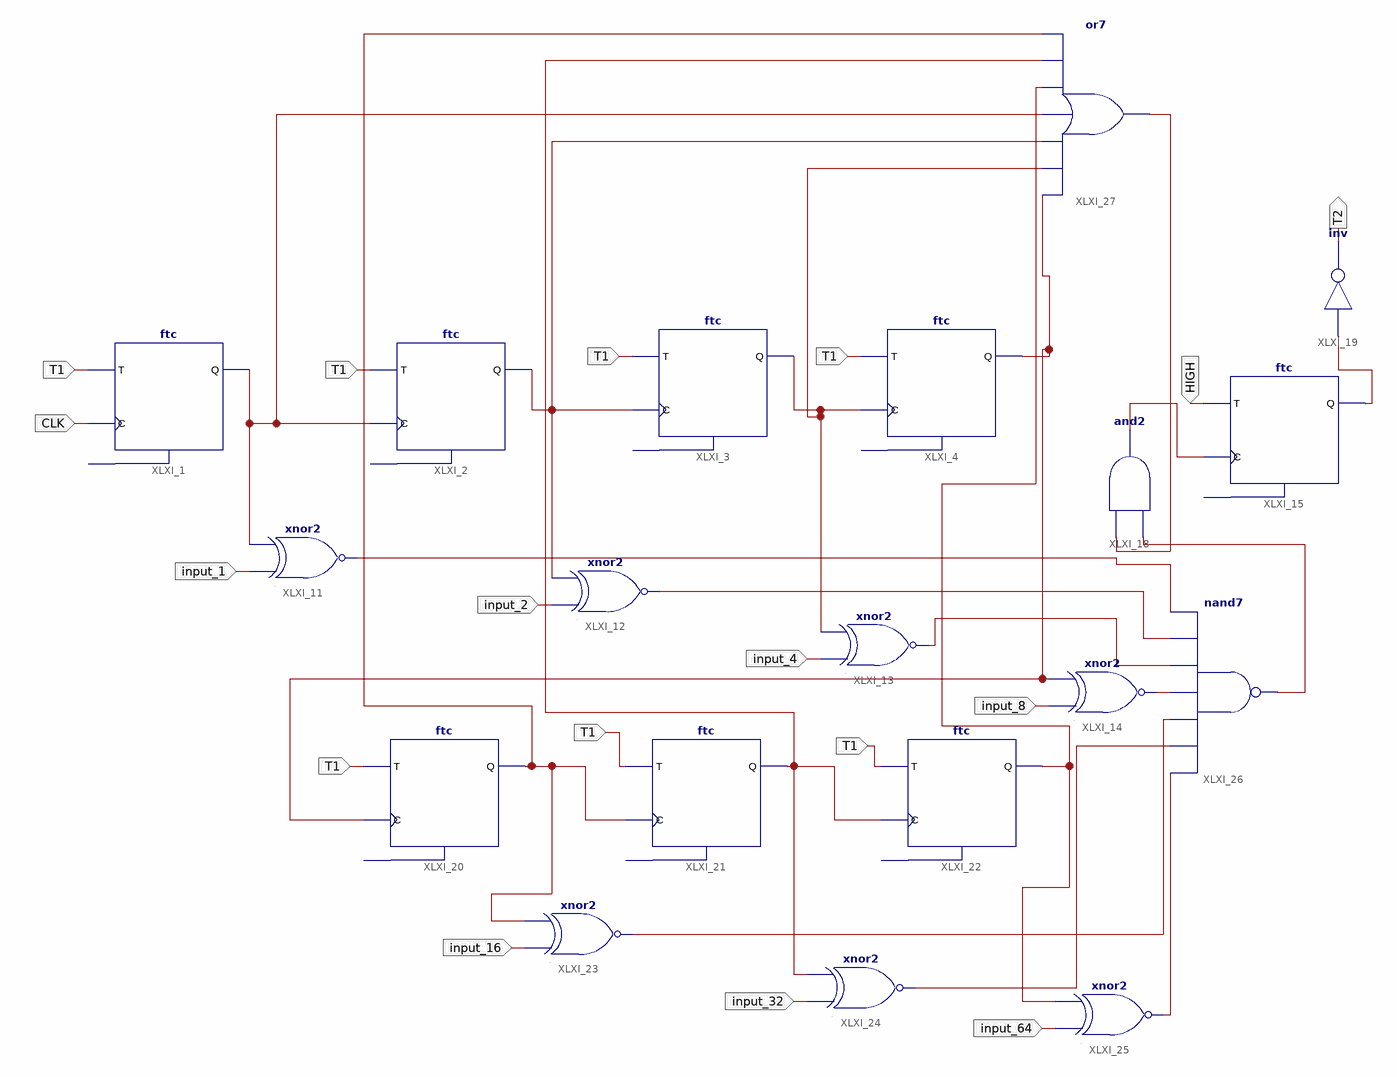
[diagram p0: schematic sheet 1]
// Xilinx ISE schematic PWM1.sch (aspartan6) as structural Verilog: 19 symbols, 11 ports
module PWM1 (
  input  CLK,
  input  input_1,
  input  input_2,
  input  input_4,
  input  input_8,
  input  T1,
  input  HIGH,
  input  input_16,
  input  input_32,
  input  input_64,
  output T2
);

  wire XLXN_3, XLXN_16, XLXN_39, XLXN_40, XLXN_41, XLXN_47, XLXN_52, XLXN_53, XLXN_56, XLXN_61, XLXN_62,
       XLXN_63, XLXN_64, XLXN_65, XLXN_66, XLXN_67, XLXN_68, XLXN_69;

  ftc XLXI_1 (.C(CLK), .T(T1), .Q(XLXN_40));  // open: CLR
  ftc XLXI_2 (.C(XLXN_40), .T(T1), .Q(XLXN_39));  // open: CLR
  ftc XLXI_3 (.C(XLXN_39), .T(T1), .Q(XLXN_3));  // open: CLR
  ftc XLXI_4 (.C(XLXN_3), .T(T1), .Q(XLXN_56));  // open: CLR
  xnor XLXI_11 (XLXN_66, input_1, XLXN_40);
  xnor XLXI_12 (XLXN_16, input_2, XLXN_39);
  xnor XLXI_13 (XLXN_65, input_4, XLXN_3);
  xnor XLXI_14 (XLXN_61, input_8, XLXN_56);
  ftc XLXI_15 (.C(XLXN_41), .T(HIGH), .Q(XLXN_47));  // open: CLR
  and XLXI_18 (XLXN_41, XLXN_67, XLXN_69);
  not XLXI_19 (T2, XLXN_47);
  ftc XLXI_20 (.C(XLXN_56), .T(T1), .Q(XLXN_52));  // open: CLR
  ftc XLXI_21 (.C(XLXN_52), .T(T1), .Q(XLXN_53));  // open: CLR
  ftc XLXI_22 (.C(XLXN_53), .T(T1), .Q(XLXN_68));  // open: CLR
  xnor XLXI_23 (XLXN_64, input_16, XLXN_52);
  xnor XLXI_24 (XLXN_63, input_32, XLXN_53);
  xnor XLXI_25 (XLXN_62, input_64, XLXN_68);
  nand XLXI_26 (XLXN_67, XLXN_62, XLXN_63, XLXN_64, XLXN_61, XLXN_65, XLXN_16, XLXN_66);
  or XLXI_27 (XLXN_69, XLXN_56, XLXN_3, XLXN_39, XLXN_40, XLXN_68, XLXN_53, XLXN_52);
endmodule
